# EAGLE design 68kshunt (EAGLE 7.7.0)
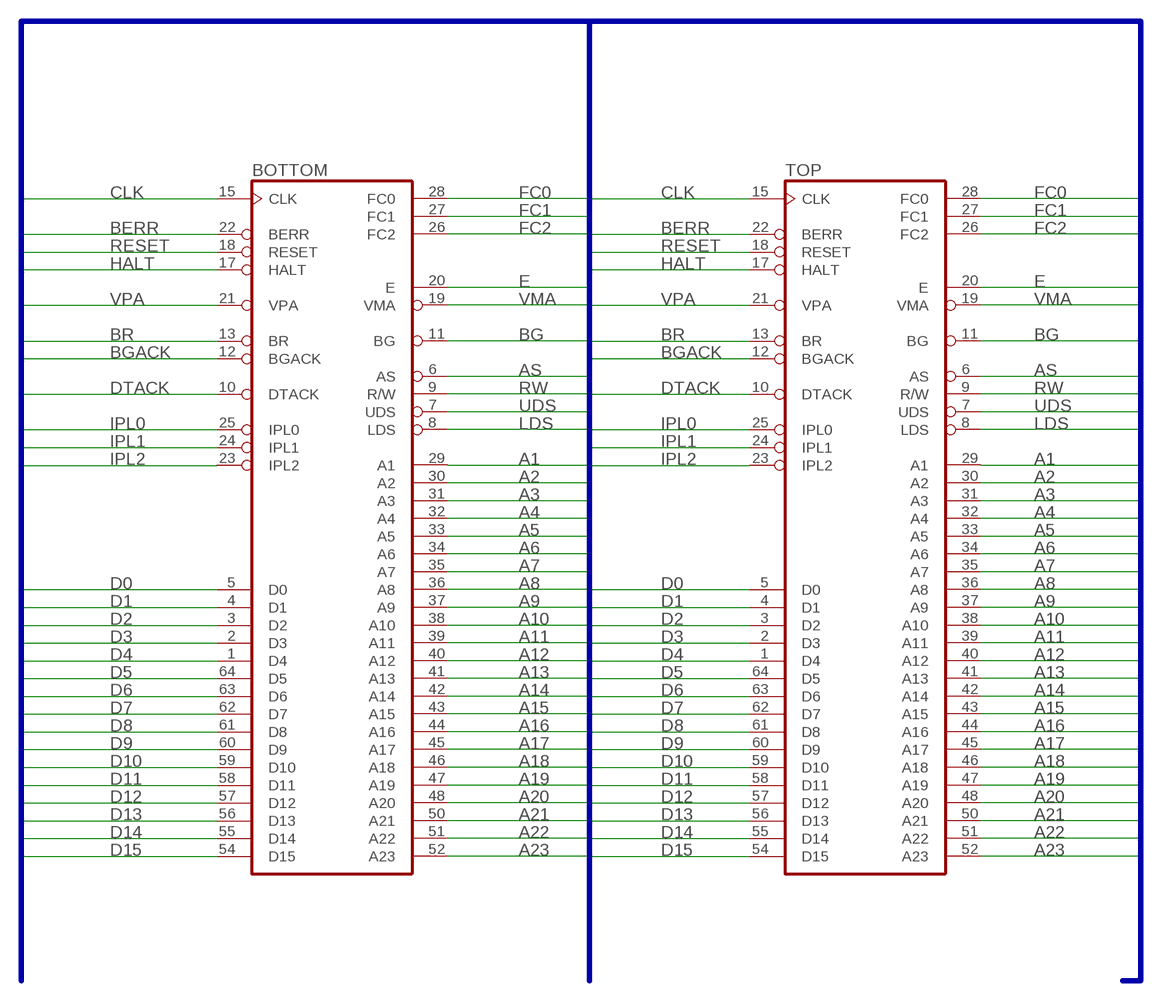
[diagram p0: schematic, sheet 1]

## Parts
BOTTOM  MC68000P  [DIL64]
TOP  MC68000P  [DIL64]

## Nets
A1: BOTTOM.29(A1) TOP.29(A1)
A2: BOTTOM.30(A2) TOP.30(A2)
A3: BOTTOM.31(A3) TOP.31(A3)
A4: BOTTOM.32(A4) TOP.32(A4)
A5: BOTTOM.33(A5) TOP.33(A5)
A6: BOTTOM.34(A6) TOP.34(A6)
A7: BOTTOM.35(A7) TOP.35(A7)
A8: BOTTOM.36(A8) TOP.36(A8)
A9: BOTTOM.37(A9) TOP.37(A9)
A10: BOTTOM.38(A10) TOP.38(A10)
A11: BOTTOM.39(A11) TOP.39(A11)
A12: BOTTOM.40(A12) TOP.40(A12)
A13: BOTTOM.41(A13) TOP.41(A13)
A14: BOTTOM.42(A14) TOP.42(A14)
A15: BOTTOM.43(A15) TOP.43(A15)
A16: BOTTOM.44(A16) TOP.44(A16)
A17: BOTTOM.45(A17) TOP.45(A17)
A18: BOTTOM.46(A18) TOP.46(A18)
A19: BOTTOM.47(A19) TOP.47(A19)
A20: BOTTOM.48(A20) TOP.48(A20)
A21: BOTTOM.50(A21) TOP.50(A21)
A22: BOTTOM.51(A22) TOP.51(A22)
A23: BOTTOM.52(A23) TOP.52(A23)
AS: BOTTOM.6(AS) TOP.6(AS)
BERR: BOTTOM.22(BERR) TOP.22(BERR)
BG: BOTTOM.11(BG) TOP.11(BG)
BGACK: BOTTOM.12(BGACK) TOP.12(BGACK)
BR: BOTTOM.13(BR) TOP.13(BR)
CLK: BOTTOM.15(CLK) TOP.15(CLK)
D0: BOTTOM.5(D0) TOP.5(D0)
D1: BOTTOM.4(D1) TOP.4(D1)
D2: BOTTOM.3(D2) TOP.3(D2)
D3: BOTTOM.2(D3) TOP.2(D3)
D4: BOTTOM.1(D4) TOP.1(D4)
D5: BOTTOM.64(D5) TOP.64(D5)
D6: BOTTOM.63(D6) TOP.63(D6)
D7: BOTTOM.62(D7) TOP.62(D7)
D8: BOTTOM.61(D8) TOP.61(D8)
D9: BOTTOM.60(D9) TOP.60(D9)
D10: BOTTOM.59(D10) TOP.59(D10)
D11: BOTTOM.58(D11) TOP.58(D11)
D12: BOTTOM.57(D12) TOP.57(D12)
D13: BOTTOM.56(D13) TOP.56(D13)
D14: BOTTOM.55(D14) TOP.55(D14)
D15: BOTTOM.54(D15) TOP.54(D15)
DTACK: BOTTOM.10(DTACK) TOP.10(DTACK)
E: BOTTOM.20(E) TOP.20(E)
FC0: BOTTOM.28(FC0) TOP.28(FC0)
FC1: BOTTOM.27(FC1) TOP.27(FC1)
FC2: BOTTOM.26(FC2) TOP.26(FC2)
HALT: BOTTOM.17(HALT) TOP.17(HALT)
IPL0: BOTTOM.25(IPL0) TOP.25(IPL0)
IPL1: BOTTOM.24(IPL1) TOP.24(IPL1)
IPL2: BOTTOM.23(IPL2) TOP.23(IPL2)
LDS: BOTTOM.8(LDS) TOP.8(LDS)
RESET: BOTTOM.18(RESET) TOP.18(RESET)
RW: BOTTOM.9(R/W) TOP.9(R/W)
UDS: BOTTOM.7(UDS) TOP.7(UDS)
VMA: BOTTOM.19(VMA) TOP.19(VMA)
VPA: BOTTOM.21(VPA) TOP.21(VPA)

## Buses
CLK,BERR,RESET,HALT,VPA,BR,BGACK,DTACK,IPL[0..2],D[0..15],FC[0..2],E,VMA,BG,AS,RW,UDS,LDS,A[1..23]

## Power pins joined to a net without a drawn wire
GND: BOTTOM.16(GND1) BOTTOM.53(GND2) TOP.16(GND1) TOP.53(GND2)
VCC: BOTTOM.14(VCC1) BOTTOM.49(VCC2) TOP.14(VCC1) TOP.49(VCC2)

## Library data of the parts
BOTTOM TOP = micro-mc68000:MC68000P: 68xxx PROCESSOR; OC_FARNELL: unknown; OC_NEWARK: unknown

## Board
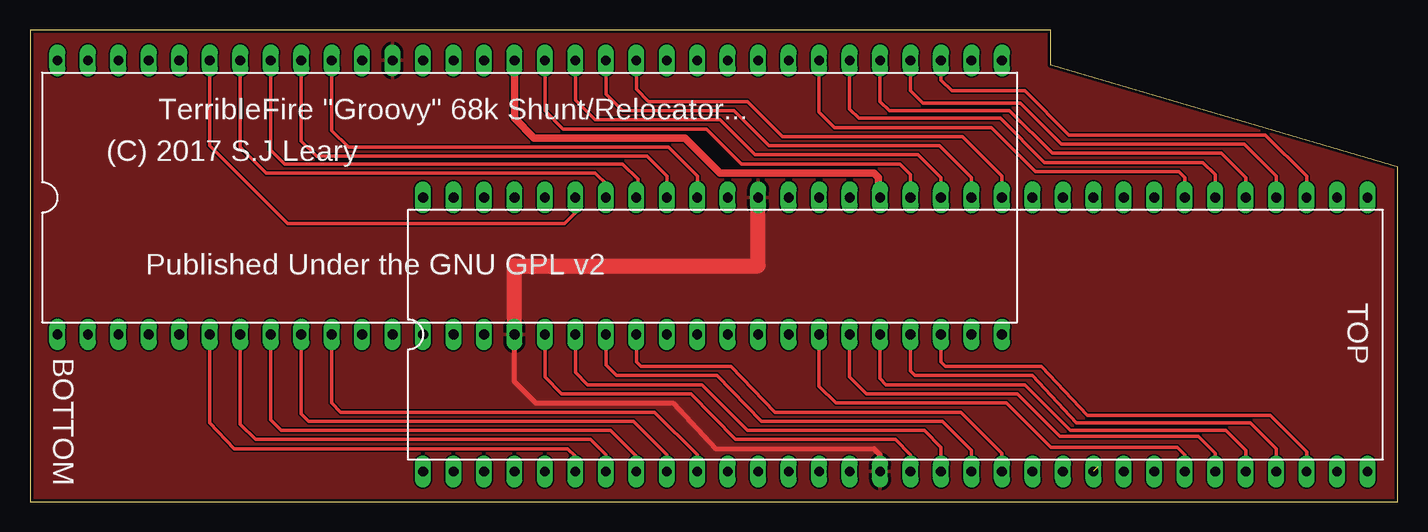
[diagram p1: board, top side]
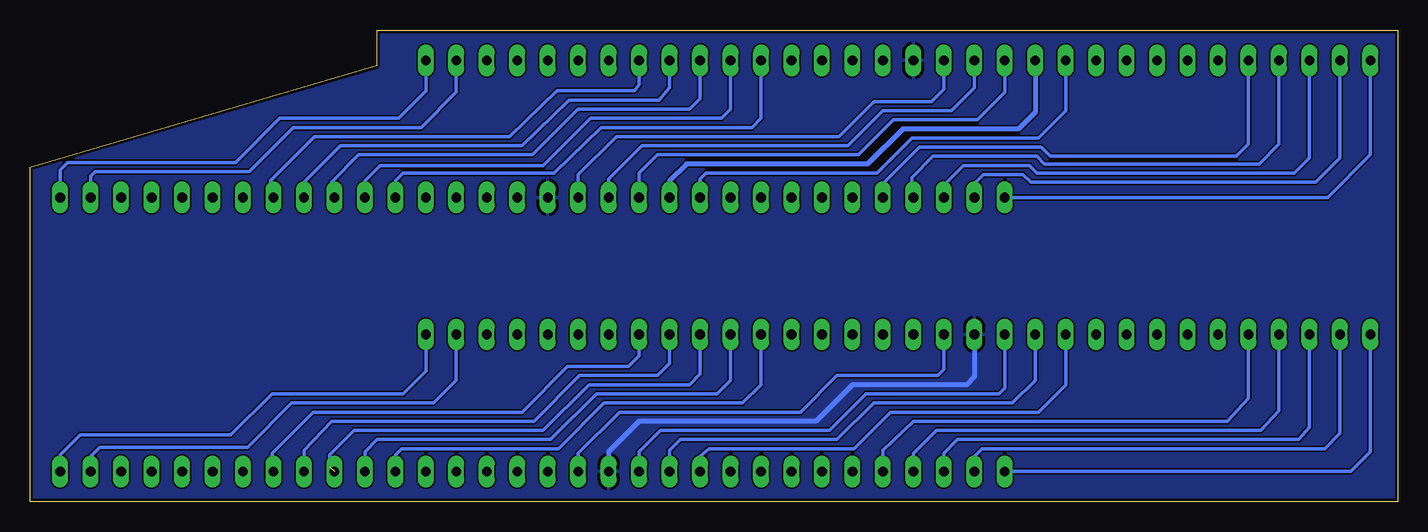
[diagram p2: board, bottom side, seen from below]

Size 114.03 x 39.37 mm. Coordinates in mm from the lower left corner, seen from the top.
Outline: 0,0 114.03,0 114.03,27.94 85.09,36.45 85.09,39.37 0,39.37 0,0
Copper layers (1*16): Top 0.035mm / dielectric 1.5mm / Bottom 0.035mm
Design rules "dirt_cheap_dirty_boards.v1": minimum track width 5mil, minimum drill 12mil, track to track 5mil, track to pad 5mil, pad to pad 5mil, via to via 5mil, smd to smd 0mil, copper to edge 10mil, drill to drill 10mil, minimum pad ring 10mil, minimum via ring 6mil, stop-mask expansion 2mil, vias tented up to drill 25mil, thermal gap 10mil

### Footprints (pad centres in the part's own frame; a part is rotated, then mirrored left to right if it is on the bottom)
DIL64 = drill 0.813 long: 1 -39.37,-11.43; 2 -36.83,-11.43; 3 -34.29,-11.43; 4 -31.75,-11.43; 5 -29.21,-11.43; 6 -26.67,-11.43; 7 -24.13,-11.43; 8 -21.59,-11.43; 9 -19.05,-11.43; 10 -16.51,-11.43; 11 -13.97,-11.43; 12 -11.43,-11.43; 13 -8.89,-11.43; 14 -6.35,-11.43; 15 -3.81,-11.43; 16 -1.27,-11.43; 17 1.27,-11.43; 18 3.81,-11.43; 19 6.35,-11.43; 20 8.89,-11.43; 21 11.43,-11.43; 22 13.97,-11.43; 23 16.51,-11.43; 24 19.05,-11.43; 25 21.59,-11.43; 26 24.13,-11.43; 27 26.67,-11.43; 28 29.21,-11.43; 29 31.75,-11.43; 30 34.29,-11.43; 31 36.83,-11.43; 32 39.37,-11.43; 33 39.37,11.43; 34 36.83,11.43; 35 34.29,11.43; 36 31.75,11.43; 37 29.21,11.43; 38 26.67,11.43; 39 24.13,11.43; 40 21.59,11.43; 41 19.05,11.43; 42 16.51,11.43; 43 13.97,11.43; 44 11.43,11.43; 45 8.89,11.43; 46 6.35,11.43; 47 3.81,11.43; 48 1.27,11.43; 49 -1.27,11.43; 50 -3.81,11.43; 51 -6.35,11.43; 52 -8.89,11.43; 53 -11.43,11.43; 54 -13.97,11.43; 55 -16.51,11.43; 56 -19.05,11.43; 57 -21.59,11.43; 58 -24.13,11.43; 59 -26.67,11.43; 60 -29.21,11.43; 61 -31.75,11.43; 62 -34.29,11.43; 63 -36.83,11.43; 64 -39.37,11.43

### Placement (x,y rotation side)
BOTTOM  41.66,25.4 0 top
TOP  72.14,13.97 0 top

### Tracks (layer width: path | path; a pad name or v marks a point on that pad's centre or on a via)
A1
  Top 0.305: BOTTOM.29 73.41,10.92 73.79,10.54 83.57,10.54 87.25,6.6 101.73,6.6 103.89,4.45 TOP.29
A2
  Top 0.305: BOTTOM.30 75.95,11.68 76.33,11.3 84.33,11.3 88.14,7.24 103.38,7.24 106.43,4.19 TOP.30
A3
  Bottom 0.305: BOTTOM.31 78.49,10.16 80.39,8.26 92.2,8.26 95.89,4.57 108.2,4.57 108.97,3.81 TOP.31
A4
  Bottom 0.305: BOTTOM.32 81.03,10.92 82.93,9.02 93.85,9.02 97.28,5.59 109.86,5.59 111.51,3.94 TOP.32
A5
  Bottom 0.305: BOTTOM.33 81.03,34.29 83.31,32 93.22,32 96.9,28.32 110.87,28.32 111.51,27.69 TOP.33 111.51,26.67
A6
  Bottom 0.305: BOTTOM.34 78.49,34.16 81.41,31.24 92.08,31.24 95.76,27.56 108.58,27.56 108.97,27.18 TOP.34
A7
  Top 0.305: BOTTOM.35 75.95,35.18 76.83,34.29 82.93,34.29 86.61,30.61 103,30.61 106.43,27.18 TOP.35
A8
  Top 0.305: BOTTOM.36 73.41,34.29 74.42,33.27 82.55,33.27 85.98,29.84 101.22,29.84 103.89,27.18 TOP.36
A9
  Top 0.305: BOTTOM.37 70.87,33.4 71.63,32.64 81.66,32.64 85.22,29.08 99.31,29.08 101.35,27.05 TOP.37
A10
  Top 0.305: BOTTOM.38 68.33,32.77 69.09,32 80.9,32 84.58,28.32 97.79,28.32 98.81,27.3 TOP.38
A11
  Top 0.305: BOTTOM.39 65.79,32.51 67.06,31.24 80.14,31.24 83.82,27.56 95.76,27.56 96.27,27.05 TOP.39
A12
  Bottom 0.305: BOTTOM.40 63.25,34.8 63.63,34.29 70.1,34.29 74.04,30.48 90.3,30.48 93.98,26.8 93.98,25.65 TOP.40
A13
  Bottom 0.305: BOTTOM.41 60.71,34.54 61.59,33.53 69.09,33.53 73.03,29.72 88.14,29.72 91.19,26.67 TOP.41
A14
  Bottom 0.305: BOTTOM.42 58.17,33.66 59.05,32.77 68.33,32.77 72.14,28.96 86.61,28.96 88.9,26.67 88.9,25.65 TOP.42
A15
  Bottom 0.305: TOP.43 86.11,26.8 84.84,28.07 71.25,28.07 67.31,32 56.39,32 55.63,32.77 BOTTOM.43
A16
  Bottom 0.305: BOTTOM.44 53.09,32 53.85,31.24 66.42,31.24 70.36,27.43 82.93,27.43 83.57,26.8 TOP.44
A17
  Top 0.305: BOTTOM.45 50.55,34.42 51.56,33.4 59.82,33.4 62.74,30.48 77.72,30.48 81.03,27.18 TOP.45
A18
  Top 0.305: BOTTOM.46 48.01,34.04 49.4,32.64 58.67,32.64 61.59,29.72 75.82,29.72 78.49,27.05 TOP.46
A19
  Top 0.305: BOTTOM.47 45.47,33.53 47.12,31.88 57.53,31.88 60.45,28.96 74.04,28.96 75.95,27.05 TOP.47
A20
  Top 0.305: BOTTOM.48 42.93,32.64 44.45,31.11 56.39,31.11 59.31,28.19 72.52,28.19 73.41,27.3 TOP.48
A21
  Bottom 0.305: BOTTOM.50 37.85,34.42 38.86,33.4 43.69,33.4 46.61,30.48 65.15,30.48 68.33,27.3 TOP.50
A22
  Bottom 0.305: BOTTOM.51 35.31,34.54 37.21,32.64 42.93,32.64 45.85,29.72 62.99,29.72 65.79,26.92 TOP.51
A23
  Bottom 0.305: BOTTOM.52 32.77,34.16 35.05,31.88 42.04,31.88 44.96,28.96 61.72,28.96 63.25,27.43 TOP.52
AS
  Top 0.305: BOTTOM.6 14.99,6.6 17.02,4.45 44.83,4.45 45.47,3.81 TOP.6
BERR
  Bottom 0.305: BOTTOM.22 55.63,10.16 56.77,9.02 66.8,9.02 70.61,5.21 85.09,5.21 86.11,4.19 TOP.22
BG
  Bottom 0.305: TOP.11 58.17,3.81 57.4,4.45 45.34,4.45 42.29,7.49 29.97,7.49 27.69,9.78 BOTTOM.11
BGACK
  Bottom 0.305: BOTTOM.12 30.23,10.16 32.13,8.26 43.69,8.26 46.74,5.21 59.82,5.21 60.71,4.32 TOP.12
BR
  Bottom 0.305: BOTTOM.13 32.77,9.53 33.27,9.02 44.32,9.02 47.37,5.97 61.47,5.97 63.25,4.19 TOP.13
CLK
  Bottom 0.305: BOTTOM.15 37.85,11.05 38.35,10.54 46.74,10.54 49.78,7.49 64.9,7.49 68.33,4.06 TOP.15
D0
  Bottom 0.305: BOTTOM.5 12.45,8.64 14.22,6.73 40.39,6.73 42.93,4.32 TOP.5
D1
  Bottom 0.305: BOTTOM.4 9.91,7.62 11.43,5.97 38.48,5.97 40.39,4.06 TOP.4
D2
  Bottom 0.305: BOTTOM.3 7.37,6.22 8.26,5.21 36.7,5.21 37.85,4.06 TOP.3
D3
  Bottom 0.305: BOTTOM.2 4.83,5.71 6.1,4.45 34.67,4.45 35.43,3.68 35.43,2.67 TOP.2
D4
  Bottom 0.305: BOTTOM.1 2.29,4.19 3.94,2.54 TOP.1
D5
  Bottom 0.305: BOTTOM.64 2.29,28.96 5.84,25.4 TOP.64
D6
  Bottom 0.305: BOTTOM.63 4.83,28.7 6.86,26.67 30.61,26.67 31.24,27.3 34.54,27.3 35.69,26.16 35.69,25.78 TOP.63
D7
  Bottom 0.305: BOTTOM.62 7.37,28.7 8.64,27.43 30.1,27.43 30.73,28.07 36.2,28.07 38.1,26.16 38.1,25.65 TOP.62
D8
  Bottom 0.305: BOTTOM.61 9.91,29.84 11.56,28.19 29.46,28.19 30.1,28.83 38.73,28.83 40.51,27.05 40.51,25.53 TOP.61
D9
  Bottom 0.305: BOTTOM.60 12.45,29.84 13.46,28.83 28.96,28.83 29.72,29.59 39.88,29.59 42.93,26.54 TOP.60
D10
  Top 0.305: BOTTOM.59 14.99,29.72 21.46,23.24 44.58,23.24 45.47,24.13 TOP.59
D11
  Top 0.305: BOTTOM.58 17.53,29.59 19.68,27.43 47.12,27.43 48.13,26.42 48.13,25.53 TOP.58
D12
  Top 0.305: BOTTOM.57 20.07,29.34 21.21,28.19 49.4,28.19 50.67,26.92 50.67,25.53 TOP.57
D13
  Top 0.305: BOTTOM.56 22.61,30.1 23.88,28.83 51.44,28.83 53.09,27.18 TOP.56
D14
  Top 0.305: BOTTOM.55 25.15,30.99 26.54,29.59 53.21,29.59 55.63,27.18 TOP.55
D15
  Bottom 0.305: BOTTOM.54 27.69,32.64 29.97,30.35 40.51,30.35 43.43,27.43 57.66,27.43 58.17,26.92 TOP.54
DTACK
  Top 0.305: BOTTOM.10 25.15,8.26 25.91,7.49 52.07,7.49 55.63,3.94 TOP.10
E
  Top 0.305: BOTTOM.20 50.55,11.68 50.93,11.3 58.42,11.3 62.1,7.49 77.6,7.49 81.03,4.06 TOP.20
FC0
  Top 0.305: BOTTOM.28 70.87,10.29 71.37,9.78 82.93,9.78 86.74,5.97 99.69,5.97 101.35,4.32 TOP.28
FC1
  Top 0.305: BOTTOM.27 68.33,10.41 69.72,9.02 82.3,9.02 85.85,5.46 97.41,5.46 98.81,4.06 TOP.27
FC2
  Top 0.305: BOTTOM.26 65.79,9.65 67.18,8.26 81.41,8.26 85.09,4.57 95.63,4.57 96.27,3.94 TOP.26
GND
  Top 0.406: BOTTOM.16 40.39,10.03 42.16,8.26 53.59,8.26 57.15,4.45 70.36,4.45 70.87,3.94 TOP.16
  Top 1.27: BOTTOM.16 40.39,19.68 60.71,19.68 TOP.53
  Bottom 0.406: BOTTOM.53 30.23,32.51 31.62,31.11 41.27,31.11 44.2,28.19 59.31,28.19 60.71,26.8 TOP.53
  pour Top: 0.13,39.24 84.84,39.24 84.84,36.32 113.92,27.81 113.79,0.13 0.13,0.13
HALT
  Top 0.305: BOTTOM.17 42.93,10.41 44.32,9.02 55.12,9.02 58.8,5.21 72.14,5.21 73.41,3.94 TOP.17
IPL0
  Bottom 0.305: BOTTOM.25 63.25,12.19 64.14,11.3 69.22,11.3 73.03,7.49 90.42,7.49 93.85,4.06 93.85,2.67 TOP.25
IPL1
  Bottom 0.305: BOTTOM.24 60.71,11.56 61.72,10.54 68.2,10.54 72.01,6.73 88.9,6.73 91.19,4.32 TOP.24
IPL2  (1 unrouted)
  Bottom 0.305: BOTTOM.23 58.17,10.67 59.05,9.78 67.44,9.78 71.25,5.97 87,5.97 89.03,3.94 89.03,2.92
LDS
  Top 0.305: BOTTOM.8 20.07,6.86 20.95,5.97 48.39,5.97 50.55,3.81 TOP.8
RESET
  Top 0.305: BOTTOM.18 45.47,10.79 46.48,9.78 56.01,9.78 59.82,5.97 74.55,5.97 75.95,4.57 TOP.18
RW
  Top 0.305: BOTTOM.9 22.61,7.37 23.24,6.73 50.29,6.73 53.09,3.94 TOP.9
UDS
  Top 0.305: BOTTOM.7 17.53,6.48 18.8,5.21 46.74,5.21 48.01,3.94 TOP.7
VCC
  Top 0.305: 70.74,25.53 TOP.49
  Top 0.61: BOTTOM.49 40.39,32 42.04,30.35 54.61,30.35 57.53,27.43 70.36,27.43 70.74,27.05 70.74,25.53
  Bottom 0.406: BOTTOM.14 35.31,10.41 35.94,9.78 45.47,9.78 48.51,6.73 63.25,6.73 65.79,4.19 TOP.14
  pour Bottom: 0.13,39.24 84.84,38.99 84.84,36.07 113.92,27.56 113.79,-0.13 0.13,0.13
VMA
  Top 0.305: BOTTOM.19 48.01,11.43 48.9,10.54 57.28,10.54 60.96,6.73 76.07,6.73 78.49,4.32 TOP.19
VPA
  Bottom 0.305: BOTTOM.21 53.09,9.78 54.61,8.26 66.17,8.26 69.98,4.45 83.06,4.45 83.57,3.94 TOP.21

### Text on the board
tNames: TerribleFire "Groovy" 68k Shunt/Relocator... | (C) 2017 S.J Leary | Published Under the GNU GPL v2 | C:/Users/stephen/Downloads/bwlogo.bmp